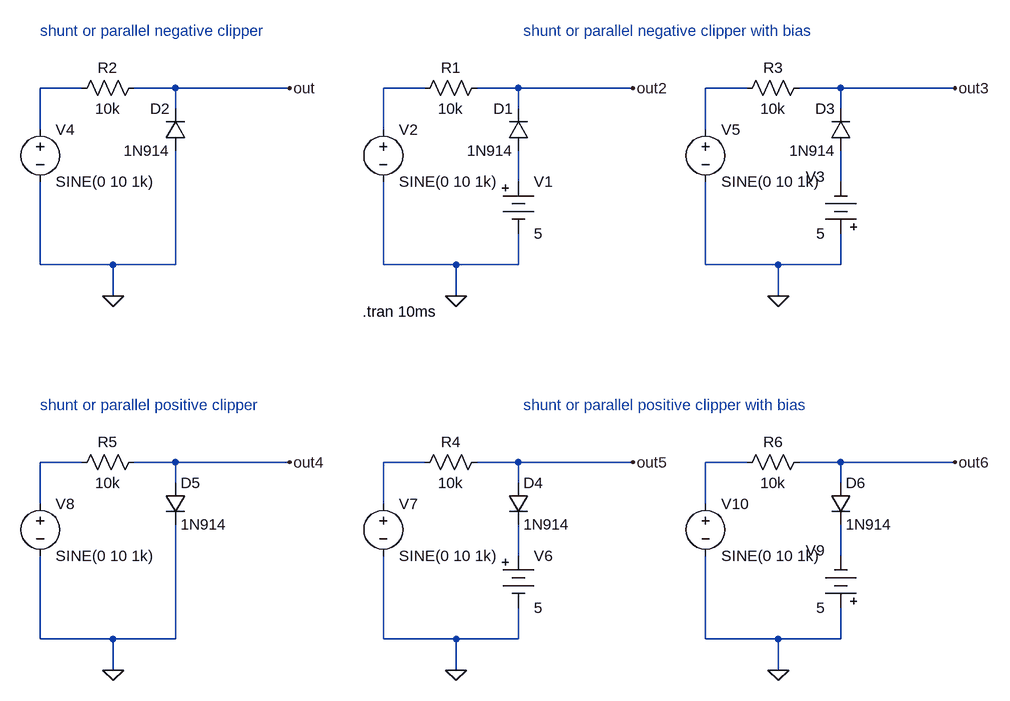
[diagram p0: schematic shunt or parallel negative and positive clipper with bias.asc]
shunt or parallel negative and positive clipper with bias.asc, the LTspice schematic file:
Version 4
SHEET 1 1020 1048
WIRE -400 112 -464 112
WIRE -256 112 -320 112
WIRE -80 112 -256 112
WIRE 128 112 64 112
WIRE 272 112 208 112
WIRE 448 112 272 112
WIRE 624 112 560 112
WIRE 768 112 704 112
WIRE 944 112 768 112
WIRE -256 144 -256 112
WIRE 272 144 272 112
WIRE 768 144 768 112
WIRE -464 176 -464 112
WIRE 64 176 64 112
WIRE 560 176 560 112
WIRE 272 256 272 208
WIRE 768 256 768 208
WIRE -464 384 -464 256
WIRE -352 384 -464 384
WIRE -256 384 -256 208
WIRE -256 384 -352 384
WIRE 64 384 64 256
WIRE 176 384 64 384
WIRE 272 384 272 336
WIRE 272 384 176 384
WIRE 560 384 560 256
WIRE 672 384 560 384
WIRE 768 384 768 336
WIRE 768 384 672 384
WIRE -352 432 -352 384
WIRE 176 432 176 384
WIRE 672 432 672 384
WIRE -400 688 -464 688
WIRE -256 688 -320 688
WIRE -80 688 -256 688
WIRE 128 688 64 688
WIRE 272 688 208 688
WIRE 448 688 272 688
WIRE 624 688 560 688
WIRE 768 688 704 688
WIRE 944 688 768 688
WIRE -256 720 -256 688
WIRE 272 720 272 688
WIRE 768 720 768 688
WIRE -464 752 -464 688
WIRE 64 752 64 688
WIRE 560 752 560 688
WIRE 272 832 272 784
WIRE 768 832 768 784
WIRE -464 960 -464 832
WIRE -352 960 -464 960
WIRE -256 960 -256 784
WIRE -256 960 -352 960
WIRE 64 960 64 832
WIRE 176 960 64 960
WIRE 272 960 272 912
WIRE 272 960 176 960
WIRE 560 960 560 832
WIRE 672 960 560 960
WIRE 768 960 768 912
WIRE 768 960 672 960
WIRE -352 1008 -352 960
WIRE 176 1008 176 960
WIRE 672 1008 672 960
FLAG 176 432 0
FLAG 448 112 out2
FLAG -352 432 0
FLAG -80 112 out
FLAG 672 432 0
FLAG 944 112 out3
FLAG 176 1008 0
FLAG 448 688 out5
FLAG -352 1008 0
FLAG -80 688 out4
FLAG 672 1008 0
FLAG 944 688 out6
SYMBOL res 224 96 R90
WINDOW 0 0 56 VBottom 2
WINDOW 3 32 56 VTop 2
SYMATTR InstName R1
SYMATTR Value 10k
SYMBOL diode 288 208 R180
WINDOW 0 24 64 Left 2
WINDOW 3 24 0 Left 2
SYMATTR InstName D1
SYMATTR Value 1N914
SYMBOL Misc\\battery 272 240 R0
SYMATTR InstName V1
SYMATTR Value 5
SYMBOL voltage 64 160 R0
WINDOW 123 0 0 Left 2
WINDOW 39 0 0 Left 2
SYMATTR InstName V2
SYMATTR Value SINE(0 10 1k)
SYMBOL res -304 96 R90
WINDOW 0 0 56 VBottom 2
WINDOW 3 32 56 VTop 2
SYMATTR InstName R2
SYMATTR Value 10k
SYMBOL diode -240 208 R180
WINDOW 0 24 64 Left 2
WINDOW 3 24 0 Left 2
SYMATTR InstName D2
SYMATTR Value 1N914
SYMBOL voltage -464 160 R0
WINDOW 123 0 0 Left 2
WINDOW 39 0 0 Left 2
SYMATTR InstName V4
SYMATTR Value SINE(0 10 1k)
SYMBOL res 720 96 R90
WINDOW 0 0 56 VBottom 2
WINDOW 3 32 56 VTop 2
SYMATTR InstName R3
SYMATTR Value 10k
SYMBOL diode 784 208 R180
WINDOW 0 24 64 Left 2
WINDOW 3 24 0 Left 2
SYMATTR InstName D3
SYMATTR Value 1N914
SYMBOL Misc\\battery 768 352 R180
WINDOW 0 24 104 Left 2
WINDOW 3 24 16 Left 2
SYMATTR InstName V3
SYMATTR Value 5
SYMBOL voltage 560 160 R0
WINDOW 123 0 0 Left 2
WINDOW 39 0 0 Left 2
SYMATTR InstName V5
SYMATTR Value SINE(0 10 1k)
SYMBOL res 224 672 R90
WINDOW 0 0 56 VBottom 2
WINDOW 3 32 56 VTop 2
SYMATTR InstName R4
SYMATTR Value 10k
SYMBOL diode 256 720 R0
SYMATTR InstName D4
SYMATTR Value 1N914
SYMBOL Misc\\battery 272 816 R0
SYMATTR InstName V6
SYMATTR Value 5
SYMBOL voltage 64 736 R0
WINDOW 123 0 0 Left 2
WINDOW 39 0 0 Left 2
SYMATTR InstName V7
SYMATTR Value SINE(0 10 1k)
SYMBOL res -304 672 R90
WINDOW 0 0 56 VBottom 2
WINDOW 3 32 56 VTop 2
SYMATTR InstName R5
SYMATTR Value 10k
SYMBOL diode -272 720 R0
SYMATTR InstName D5
SYMATTR Value 1N914
SYMBOL voltage -464 736 R0
WINDOW 123 0 0 Left 2
WINDOW 39 0 0 Left 2
SYMATTR InstName V8
SYMATTR Value SINE(0 10 1k)
SYMBOL res 720 672 R90
WINDOW 0 0 56 VBottom 2
WINDOW 3 32 56 VTop 2
SYMATTR InstName R6
SYMATTR Value 10k
SYMBOL diode 752 720 R0
SYMATTR InstName D6
SYMATTR Value 1N914
SYMBOL Misc\\battery 768 928 R180
WINDOW 0 24 104 Left 2
WINDOW 3 24 16 Left 2
SYMATTR InstName V9
SYMATTR Value 5
SYMBOL voltage 560 736 R0
WINDOW 123 0 0 Left 2
WINDOW 39 0 0 Left 2
SYMATTR InstName V10
SYMATTR Value SINE(0 10 1k)
TEXT 32 456 Left 2 !.tran 10ms
TEXT -464 24 Left 2 ;shunt or parallel negative clipper
TEXT 280 24 Left 2 ;shunt or parallel negative clipper with bias
TEXT -464 600 Left 2 ;shunt or parallel positive clipper
TEXT 280 600 Left 2 ;shunt or parallel positive clipper with bias

The netlist it stands for:
* shunt or parallel negative and positive clipper with bias.asc
R1 out2 N002 10k
D1 N004 out2 1N914
V1 N004 0 5
V2 N002 0 SINE(0 10 1k)
R2 out N001 10k
D2 0 out 1N914
V4 N001 0 SINE(0 10 1k)
R3 out3 N003 10k
D3 N005 out3 1N914
V3 0 N005 5
V5 N003 0 SINE(0 10 1k)
R4 out5 N007 10k
D4 out5 N009 1N914
V6 N009 0 5
V7 N007 0 SINE(0 10 1k)
R5 out4 N006 10k
D5 out4 0 1N914
V8 N006 0 SINE(0 10 1k)
R6 out6 N008 10k
D6 out6 N010 1N914
V9 0 N010 5
V10 N008 0 SINE(0 10 1k)
.model D D
.lib standard.dio
.tran 10ms
* shunt or parallel negative clipper
* shunt or parallel negative clipper with bias
* shunt or parallel positive clipper
* shunt or parallel positive clipper with bias
.backanno
.end